# EAGLE design tpa2008d_breakout_board (EAGLE 9.6.2)
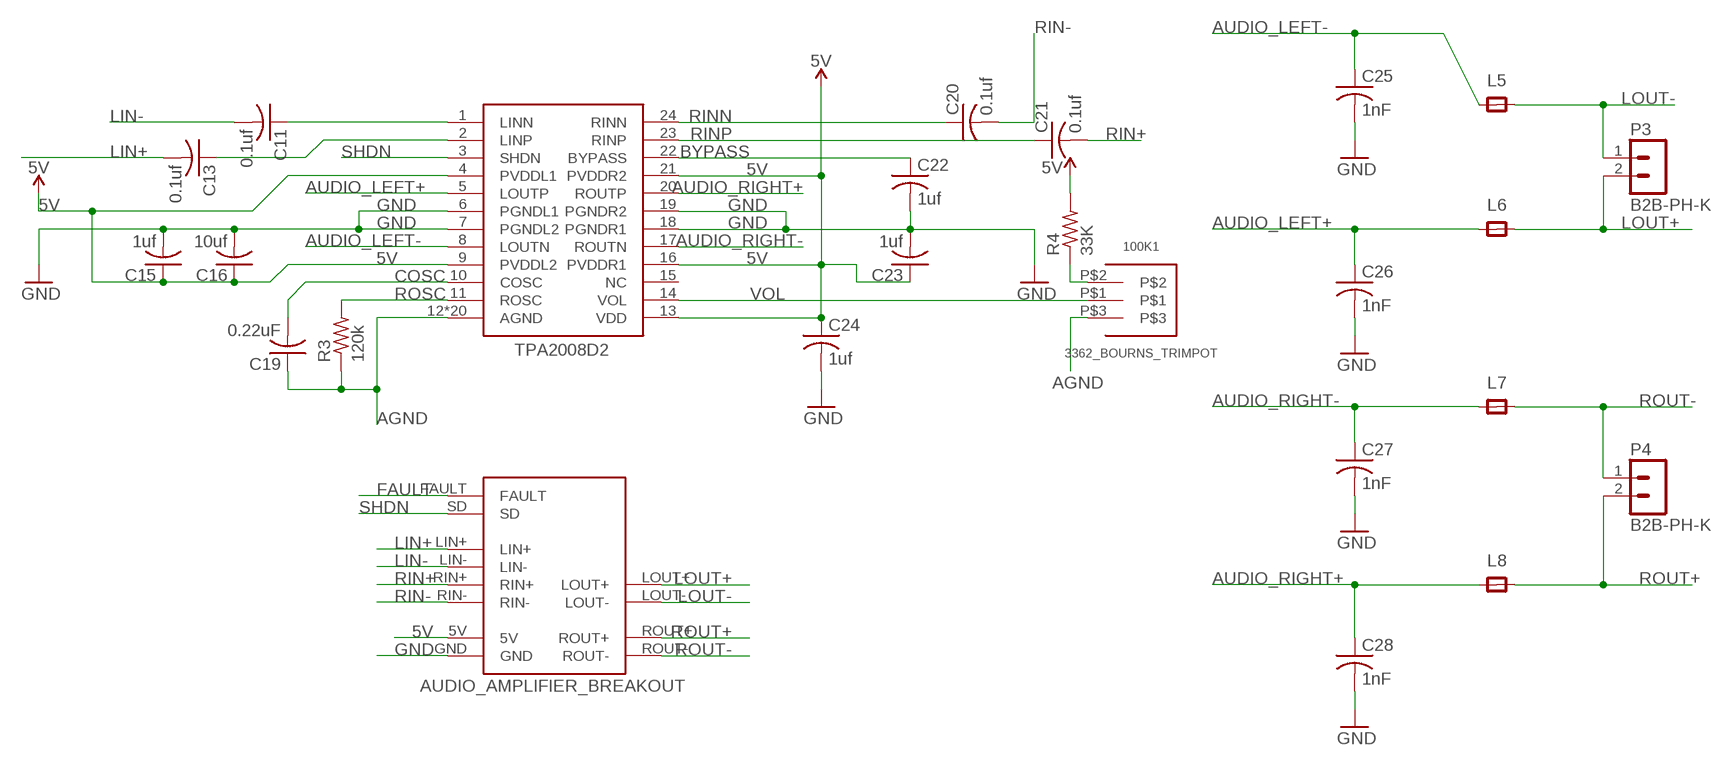
[diagram p0: schematic, sheet 1]

## Parts
100K1  3362_BOURNS_TRIMPOT  [3362_BOURNS_TRIMPOT]
C11  0.1uf  C-USC0805  [C0805]
C13  0.1uf  C-USC0805  [C0805]
C15  1uf  C-USC0805  [C0805]
C16  10uf  C-USC0805  [C0805]
C19  0.22uF  C-USC0805  [C0805]
C20  0.1uf  C-USC0805  [C0805]
C21  0.1uf  C-USC0805  [C0805]
C22  1uf  C-USC0805  [C0805]
C23  1uf  C-USC0805  [C0805]
C24  1uf  C-USC0805  [C0805]
C25  1nF  C-USC0805  [C0805]
C26  1nF  C-USC0805  [C0805]
C27  1nF  C-USC0805  [C0805]
C28  1nF  C-USC0805  [C0805]
L5  600Ohm@100MHz  RC-MASTER-SMD_FB_1206MP  [RC-MASTER-SMD_L1206MP]
L6  600Ohm@100MHz  RC-MASTER-SMD_FB_1206MP  [RC-MASTER-SMD_L1206MP]
L7  600Ohm@100MHz  RC-MASTER-SMD_FB_1206MP  [RC-MASTER-SMD_L1206MP]
L8  600Ohm@100MHz  RC-MASTER-SMD_FB_1206MP  [RC-MASTER-SMD_L1206MP]
P3  B2B-PH-K  [B2B-PH-K]
P4  B2B-PH-K  [B2B-PH-K]
R3  120k  R-US_M0805  [M0805]
R4  33K  R-US_M0805  [M0805]
U$2  TPA2008D2  [PWP-TSSOP24]
U$3  AUDIO_AMPLIFIER_BREAKOUT  [AUDIO_AMPLIFIER_BREAKOUT]

## Nets
5V: C15.1 C16.1 C23.1 C24.1 R4.2 U$2.4(PVDDL1) U$2.9(PVDDL2) U$2.13(VDD) U$2.16(PVDDR1) U$2.21(PVDDR2) U$3.5V
AGND: 100K1.P$3 C19.1 R3.1 U$2.12(AGND) U$2.EXP(AGND) U$2.EXP@1(AGND) U$2.EXP@2(AGND) U$2.EXP@3(AGND) U$2.EXP@4(AGND) U$2.EXP@5(AGND) U$2.EXP@6(AGND) U$2.EXP@7(AGND) U$2.EXP@8(AGND) U$2.EXP@9(AGND) U$2.EXP@10(AGND) U$2.EXP@11(AGND) U$2.EXP@12(AGND) U$2.EXP@13(AGND) U$2.EXP@14(AGND) U$2.EXP@15(AGND) U$2.EXP@16(AGND) U$2.EXP@17(AGND) U$2.EXP@18(AGND)
AUDIO_LEFT+: C26.1 L6.1 U$2.5(LOUTP)
AUDIO_LEFT-: C25.1 L5.1 U$2.8(LOUTN)
AUDIO_RIGHT+: C28.1 L8.1 U$2.20(ROUTP)
AUDIO_RIGHT-: C27.1 L7.1 U$2.17(ROUTN)
BYPASS: C22.1 U$2.22(BYPASS)
COSC: C19.2 U$2.10(COSC)
FAULT: U$3.FAULT
GND: C15.2 C16.2 C22.2 C23.2 C24.2 C25.2 C26.2 C27.2 C28.2 U$2.6(PGNDL1) U$2.7(PGNDL2) U$2.18(PGNDR1) U$2.19(PGNDR2) U$3.GND
LIN+: C13.2 U$3.LIN+
LIN-: C11.2 U$3.LIN-
LINN-1: C11.1 U$2.1(LINN)
LINP-1: C13.1 U$2.2(LINP)
LOUT+: L6.2 P3.2 U$3.LOUT+
LOUT-: L5.2 P3.1 U$3.LOUT-
N$2: 100K1.P$2 R4.1
RIN+: C21.2 U$3.RIN+
RIN-: C20.2 U$3.RIN-
RINN: C20.1 U$2.24(RINN)
RINP: C21.1 U$2.23(RINP)
ROSC: R3.2 U$2.11(ROSC)
ROUT+: L8.2 P4.2 U$3.ROUT+
ROUT-: L7.2 P4.1 U$3.ROUT-
SHDN: U$2.3(SHDN) U$3.SD
VOL: 100K1.P$1 U$2.14(VOL)
Unconnected: U$2.15(NC)

## Library data of the parts
100K1 = nathans-custom-parts:3362_BOURNS_TRIMPOT
C11 C13 C15 C16 C19-C28 = rcl:C-US: CAPACITOR, American symbol; SPICEPREFIX: C
L5-L8 = LinkedLibrary52101:RC-MASTER-SMD_FB_: FERRITE BEAD
P3 P4 = con-jst-ph:B2B-PH-K: HEADER
R3 R4 = adafruit:R-US_: RESISTOR, American symbol
U$2 = TPA2008D3:TPA2008D2
U$3 = nathans-custom-parts:AUDIO_AMPLIFIER_BREAKOUT

## Net classes
0 default: width 0.203 mm, drill 0.254 mm, clearance 0.203 mm

## Board
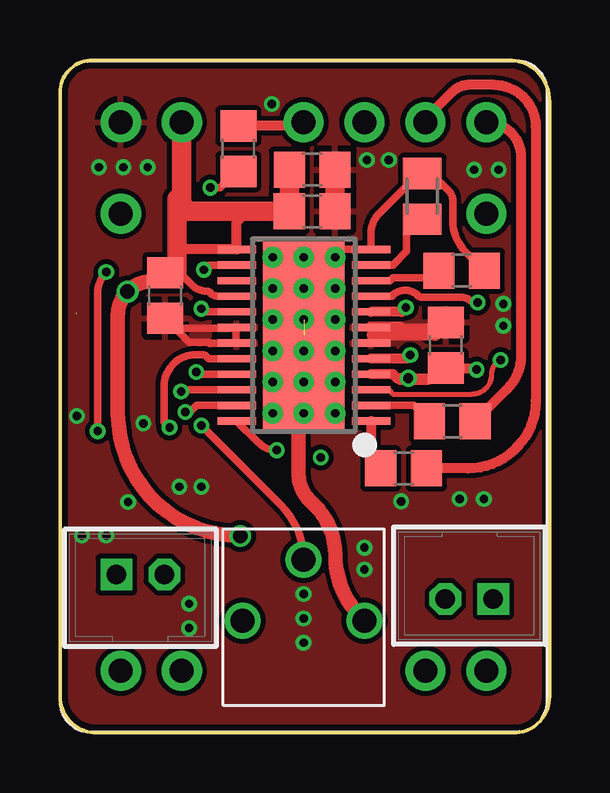
[diagram p1: board, top side]
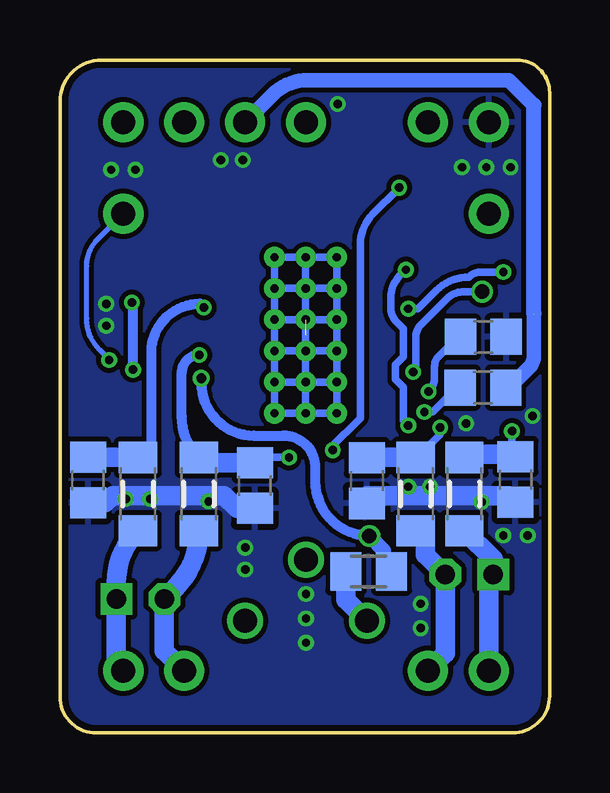
[diagram p2: board, bottom side, seen from below]

Size 20.42 x 28.04 mm. Coordinates in mm from the lower left corner, seen from the top.
Outline: 18.9,0 1.56,0 arc-90 0,1.56 0,26.67 arc-90 1.37,28.04 18.69,28.04 arc-90 20.42,26.31 20.42,1.52 arc-90 18.9,0
Copper layers (1*16): Top 0.035mm / dielectric 1.5mm / Bottom 0.035mm
Design rules "SeeedStudio_2layer_DRU_no_angle_20140221": minimum track width 6mil, minimum drill 12mil, track to track 6mil, track to pad 6mil, pad to pad 6mil, via to via 6mil, smd to smd 0mil, copper to edge 10mil, drill to drill 10mil, minimum pad ring 10mil, minimum via ring 6mil, stop-mask expansion 2mil, vias tented up to drill 100mil, thermal gap 10mil

### Footprints (pad centres in the part's own frame; a part is rotated, then mirrored left to right if it is on the bottom)
3362_BOURNS_TRIMPOT = drill 1: P$1 0,2.54; P$2 -2.54,0; P$3 2.54,0
C0805 = smd 1.3 x 1.5: 1 -0.95,0; 2 0.95,0
RC-MASTER-SMD_L1206MP = smd 1.3 x 1.6: 1 -1.524,0; 2 1.524,0
B2B-PH-K = drill 0.813 square: 1 -1,0 | drill 0.813 octagon: 2 1,0
M0805 = smd 1.3 x 1.6: 1 -0.95,0; 2 0.95,0
PWP-TSSOP24 = smd 1.6 x 0.3: 1 -2.8,3.575; 2 -2.8,2.925; 3 -2.8,2.275; 4 -2.8,1.625; 5 -2.8,0.975; 6 -2.8,0.325; 7 -2.8,-0.325; 8 -2.8,-0.975; 9 -2.8,-1.625; 10 -2.8,-2.275; 11 -2.8,-2.925; 12 -2.8,-3.575; 13 2.8,-3.575; 14 2.8,-2.925; 15 2.8,-2.275; 16 2.8,-1.625; 17 2.8,-0.975; 18 2.8,-0.325; 19 2.8,0.325; 20 2.8,0.975; 21 2.8,1.625; 22 2.8,2.275; 23 2.8,2.925; 24 2.8,3.575 | smd 3.4 x 7.8: EXP 0,0 | drill 0.35 pad 0.7: EXP@1 -1.3,3.25; EXP@2 0,3.25; EXP@3 1.3,3.25; EXP@4 -1.3,1.95; EXP@5 0,1.95; EXP@6 1.3,1.95; EXP@7 -1.3,0.65; EXP@8 0,0.65; EXP@9 1.3,0.65; EXP@10 -1.3,-0.65; EXP@11 0,-0.65; EXP@12 1.3,-0.65; EXP@13 -1.3,-1.95; EXP@14 0,-1.95; EXP@15 1.3,-1.95; EXP@16 -1.3,-3.25; EXP@17 0,-3.25; EXP@18 1.3,-3.25
AUDIO_AMPLIFIER_BREAKOUT = drill 1 pad 1.676: 5V -5.08,11.43; FAULT -7.62,7.62; GND -7.62,11.43; LIN+ 7.62,11.43; LIN- 5.08,11.43; LOUT+ 5.08,-11.43; LOUT- 7.62,-11.43; RIN+ 2.54,11.43; RIN- 0,11.43; ROUT+ -5.08,-11.43; ROUT- -7.62,-11.43; SD 7.62,7.62

### Placement (x,y rotation side)
100K1  10.16,4.67 0 top
C11  14.33,11.02 0 top
C13  16.36,12.99 0 top
C15  4.39,18.23 270 top
C16  10.52,23.47 0 top
C19  16.75,19.27 180 top
C20  7.44,24.34 90 top
C21  2.78,14.39 0 bottom
C22  2.77,16.5 0 bottom
C23  16.08,16.16 90 top
C24  10.51,21.73 0 top
C25  19.25,10.54 270 bottom
C26  12.29,10.31 270 bottom
C27  1.42,10.57 270 bottom
C28  7.62,10.52 270 bottom
L5  17.17,9.96 270 bottom
L6  14.63,9.96 270 bottom
L7  3.56,9.96 270 bottom
L8  5.59,9.96 270 bottom
P3  17.07,5.59 180 top
P4  3.35,6.6 0 top
R3  15.11,22.36 270 top
R4  7.54,6.73 0 bottom
U$2  10.17,16.57 180 top
U$3  10.16,14.02 0 top

### Tracks (layer width: path | path; a pad name or v marks a point on that pad's centre or on a via)
5V  (via drill 0.35, 0.4, 0.6)
  Top 0.305: U$2.21 5.78,14.95 v5.69,15.04 | 4.03,18.83 C15.1 4.57,19.37 4.57,19.61 4.88,19.3 5.54,18.64 arc45 6.09,18.41 arc-45 6.27,18.34 arc45 6.61,18.2 U$2.16 | U$2.9 13.83,18.2 13.86,18.22 arc-90 14.94,18.22 arc45 15.09,18.16 16.67,18.16 arc-45 17.22,17.93 v17.42,17.93 | 14.06,14.78 14.18,14.66 15.37,14.66 15.92,15.21 | 15.92,15.21 C23.1 | v17.37,15.14 16.26,15.14 15.99,15.14 15.92,15.21
  Top 0.406: 4.88,20.12 4.91,20.15 U$2.13 7.37,21.28 7.82,21.73 | U$2.4 13.89,14.95 14.06,14.78 14.07,14.78 v14.53,14.78 15.9,14.78 16.26,15.14 | C23.1 17.31,15.21 v17.37,15.14
  Top 0.61: v7.52,8.21 arc-90 2.42,13.31 2.42,17.41 arc-45 v2.82,18.39 arc-45 3.88,18.83 4.03,18.83
  Top 0.813: 4.88,19.3 4.88,20.12 4.88,22.25 5.08,22.05 | 5.08,22.05 U$3.5V | C16.1 C24.1 7.82,21.73 5.39,21.73 5.08,22.05
  Bottom 0.305: v2.82,18.39 3.57,18.39 arc-45 4.28,18.1 5.39,16.99 arc-45 5.59,16.5 5.59,15.15 5.69,15.05 v5.69,15.04
  Bottom 0.406: v7.52,8.21 7.54,8.23 arc90 9.78,10.47 9.78,11.06 arc-90 11.11,12.39 12.35,12.39 arc90 14.53,14.58 v14.53,14.78 | v17.37,15.14 17.37,17.89 v17.42,17.93
  Bottom 0.61: R4.2 6.91,7.05 6.91,7.6 v7.52,8.21
AGND  (1 unrouted)
  Top 0.305: U$2.EXP@17 10.5,20.15 U$2.12 12.97,20.82 arc-45 13.31,21.65 14.98,23.31 R3.1 15.5,23.31 16.22,22.59 arc-45 16.38,22.2 16.38,21.33 arc45 16.91,20.05 C19.1
  Top 0.61: 100K1.P$3 12.56,4.81 arc-45 11.48,7.42 arc45 10.63,9.49 10.37,9.75 arc-45 9.96,10.74 9.96,13.11 U$2.EXP@2
  Bottom 0.305: U$2.EXP@17 U$2.EXP@16 U$2.EXP@13 | U$2.EXP@17 U$2.EXP@18 U$2.EXP@15 | U$2.EXP@15 8.87,17.27 | 8.87,17.27 U$2.EXP@12 U$2.EXP@9 | U$2.EXP@9 U$2.EXP@6 | U$2.EXP@6 U$2.EXP@3 U$2.EXP@2 | U$2.EXP@2 U$2.EXP@1 U$2.EXP@4 11.28,14.62 | 11.28,14.62 U$2.EXP@5 | U$2.EXP@5 U$2.EXP@8 | U$2.EXP@2 U$2.EXP@5 | U$2.EXP@5 U$2.EXP@6 | U$2.EXP@9 U$2.EXP@8 | U$2.EXP@8 U$2.EXP@7 | U$2.EXP@7 11.47,14.82 11.28,14.62 | U$2.EXP@7 U$2.EXP@10 | U$2.EXP@10 U$2.EXP@11 | U$2.EXP@11 8.92,17.22 8.87,17.27 | U$2.EXP@15 U$2.EXP@14 | U$2.EXP@14 U$2.EXP@11 | U$2.EXP@14 U$2.EXP@17 | U$2.EXP@13 U$2.EXP@10 | U$2.EXP@13 U$2.EXP@14 | U$2.EXP@8 U$2.EXP@11
AUDIO_LEFT+  (via drill 0.35)
  Top 0.406: v14.61,15.75 14.46,15.6 U$2.5
  Bottom 0.305: v10.87,11.48 12.08,11.48 C26.1
  Bottom 0.406: L6.1 arc45 15.34,13.19 15.34,15.02 arc90 v14.61,15.75
  Bottom 0.813: L6.1 14.41,11.26 C26.1
AUDIO_LEFT-  (via drill 0.35)
  Top 0.406: v14.43,17.73 14.25,17.55 U$2.8
  Bottom 0.305: 17.18,11.49 16.86,11.49
  Bottom 0.406: v14.43,17.73 14.58,17.88 arc-90 16.61,15.86 16.61,12.09 arc45 16.86,11.49
  Bottom 0.813: C25.1 17.18,11.49 L5.1
AUDIO_RIGHT+  (via drill 0.35)
  Top 0.305: U$2.20 6.19,15.6 6.05,15.74 6.02,15.74 5.99,15.77 5.67,15.77 arc90 4.34,14.45 4.34,12.95 v4.57,12.72
  Bottom 0.305: L8.1 5.51,11.48 4.57,12.42 v4.57,12.72
  Bottom 0.813: C28.1 7.61,11.48 L8.1
AUDIO_RIGHT-  (via drill 0.35)
  Top 0.305: U$2.17 6.02,17.55 v5.89,17.68 | v1.93,19.2 arc45 1.58,18.34 v1.58,12.58
  Bottom 0.305: v5.89,17.68 5.49,17.68 4.73,18.44 arc45 3.37,19 arc45 2.88,19.2 v1.93,19.2 | 1.58,11.62 v1.58,12.58 1.58,11.67 C27.1
  Bottom 0.813: L7.1 3.42,11.62 1.58,11.62 | 1.83,11.52 C27.1
BYPASS  (via drill 0.35)
  Top 0.305: U$2.22 5.13,14.3 v5.05,14.22
  Bottom 0.305: v5.05,14.22 arc-45 4.8,14.84 4.8,15.28 arc45 4.63,15.69 3.82,16.5 C22.1
COSC
  Top 0.305: U$2.10 13.76,18.85 13.89,18.98 15.51,18.98 C19.2
GND  (via drill 0.35)
  Top 0.305: U$2.18 7.34,16.87 | 7.34,16.87 4.8,16.87 C15.2 5.39,16.28 6.2,16.28 6.23,16.25 U$2.19 7.34,16.28 7.34,16.87 | U$2.6 U$2.7
  Top 0.406: U$2.7 13.01,16.87 15.92,16.87 15.64,16.59
  Top 0.508: 15.64,16.59 13.05,16.59 | 14.18,16.89 U$2.7
  Top 0.813: C24.2 C16.2
  Bottom 0.813: C28.2 7.62,9.9 1.7,9.9 C27.2 | C26.2 13.04,9.36 13.58,9.9 18.22,9.9 18.53,9.59 C25.2
  other vias: 18.49,17.88 18.49,16.97 12.8,23.88 13.72,23.88 1.93,8.23 3.48,12.9 0.91,8.23 0.71,13.21 5.89,10.26 4.98,10.26 2.84,9.63 12.7,7.72 12.7,6.81 17.68,9.75 16.66,9.75 14.22,9.65 18.29,23.47 17.27,23.47 8.84,26.21 3.66,23.57 2.64,23.57 1.63,23.57 5.38,5.38 5.38,4.37 10.16,5.79 10.16,4.78 10.16,3.76
  pour Bottom: 18.95,0 1.39,0 arc-90 0,1.39 0,26.57 arc-90 1.37,27.94 19.11,27.94 arc-90 20.32,26.73 20.32,1.37 arc-90
  pour Top: 9.35,27.94 19.11,27.94 arc-90 20.32,26.73 20.32,1.21 arc-90 19.11,0 1.52,0 arc-90 0,1.52 0,26.73 arc-90 1.21,27.94
LIN+
  Top 0.406: U$3.LIN+ arc-90 19.23,24 19.23,15.74 arc-45 18.64,14.32 C13.2
LIN-
  Top 0.406: C11.2 17.02,11.02 arc90 19.84,13.85 19.84,25.27 arc90 18.12,27 17.03,27 arc45 16.39,26.74 15.24,25.59 U$3.LIN-
LINN-1
  Top 0.406: U$2.1 12.97,11.43 C11.1
LINP-1
  Top 0.305: C13.1 14.75,13.65 U$2.2
LOUT+
  Bottom 0.813: U$3.LOUT+ 16.07,3.42 P3.2 15.63,6.03 arc-45 L6.2
LOUT-
  Bottom 0.813: U$3.LOUT- 18.07,2.88 P3.1 18.07,6.26 arc45 L5.2
N$2
  Bottom 0.813: 100K1.P$2 8.49,5.55 R4.1
RIN+  (1 unrouted)
  Bottom 0.61: U$3.RIN+ 11.56,26.59 arc45 10.08,27.2 1.7,27.2 0.66,26.16 | 1.81,14.37 C21.2 1.7,14.39 0.85,15.25 arc-45 0.66,15.7 0.66,17.46 0.69,17.49
  Bottom 0.635: 0.66,26.16 0.66,17.48 0.65,17.47
RIN-
  Top 0.406: U$3.RIN- 10,25.29 C20.2
RINN  (via drill 0.35)
  Top 0.305: U$2.24 8.26,12.11 arc45 v9.04,11.79 | v6.27,22.72 6.67,22.72 7.34,23.39 C20.1
  Bottom 0.305: v9.04,11.79 9.14,11.88 7.9,13.12 7.9,20.38 arc45 7.39,21.61 v6.27,22.72
RINP  (via drill 0.35)
  Top 0.305: v5.23,13.38 5.42,13.38 5.69,13.65 U$2.23
  Bottom 0.305: v5.23,13.38 4.87,13.38 3.86,14.39 C21.1
ROSC
  Top 0.305: R3.2 15.08,21.41 14.45,20.78 14.45,20.08 13.88,19.5 U$2.11
ROUT+
  Bottom 0.813: L8.2 5.18,8.03 5.18,7.43 P4.2 4.35,3.32 U$3.ROUT+
ROUT-
  Bottom 0.813: U$3.ROUT- 2.54,6.42 P4.1 2.35,7.23 L7.2
SHDN  (via drill 0.35)
  Top 0.203: 13.69,14.3 U$2.3 13.72,14.3 13.89,14.12 17.19,14.12 arc90 18.01,14.94 arc-45 18.21,15.44 18.34,15.57 v18.37,15.54
  Bottom 0.203: v18.37,15.54 18.37,15.58 18.77,15.98 arc45 19.3,17.27 19.3,19.45 arc45 18.84,20.59 U$3.SD
VOL  (via drill 0.35)
  Top 0.305: U$2.14 6.19,19.5 v5.99,19.3 | v5.89,12.81 9.22,9.49 arc-45 100K1.P$1
  Bottom 0.305: v5.99,19.3 6.26,19.04 arc-45 6.63,18.15 6.63,17.73 arc-45 6.37,17.12 6.1,16.84 6.1,15.67 6.42,15.34 6.42,14.73 6.1,14.4 6.1,13.02 v5.89,12.81